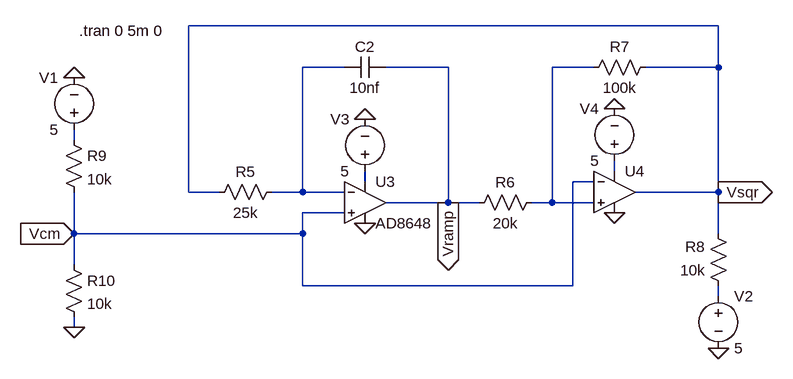
[diagram p0: schematic 01_Ramp_Generator.asc.asc]
01_Ramp_Generator.asc.asc, the LTspice schematic file:
Version 4.1
SHEET 1 928 964
WIRE 464 448 -352 448
WIRE -112 512 -176 512
WIRE 48 512 -48 512
WIRE 272 512 208 512
WIRE 464 512 464 448
WIRE 464 512 352 512
WIRE -528 624 -528 608
WIRE 304 672 304 656
WIRE -80 688 -80 672
WIRE 272 688 240 688
WIRE -352 704 -352 448
WIRE -304 704 -352 704
WIRE -176 704 -176 512
WIRE -176 704 -224 704
WIRE -112 704 -176 704
WIRE 464 704 464 512
WIRE 464 704 336 704
WIRE 48 720 48 512
WIRE 48 720 -48 720
WIRE 96 720 48 720
WIRE 208 720 208 512
WIRE 208 720 176 720
WIRE 272 720 208 720
WIRE -112 736 -176 736
WIRE -528 768 -528 704
WIRE -176 768 -176 736
WIRE -176 768 -528 768
WIRE 464 768 464 704
WIRE -528 816 -528 768
WIRE -176 848 -176 768
WIRE 240 848 240 688
WIRE 240 848 -176 848
WIRE 464 864 464 848
WIRE -528 912 -528 896
FLAG -528 768 Vcm
IOPIN -528 768 In
FLAG -528 528 0
FLAG -528 912 0
FLAG -80 752 0
FLAG 464 944 0
FLAG -80 592 0
FLAG 304 576 0
FLAG 304 736 0
FLAG 464 704 Vsqr
IOPIN 464 704 Out
FLAG 48 720 Vramp
IOPIN 48 720 Out
SYMBOL OpAmps\\AD8648 -80 656 R0
SYMATTR InstName U3
SYMBOL res -208 688 R90
WINDOW 0 0 56 VBottom 2
WINDOW 3 32 56 VTop 2
SYMATTR InstName R5
SYMATTR Value 25k
SYMBOL res 192 704 R90
WINDOW 0 0 56 VBottom 2
WINDOW 3 32 56 VTop 2
SYMATTR InstName R6
SYMATTR Value 20k
SYMBOL res 368 496 R90
WINDOW 0 0 56 VBottom 2
WINDOW 3 32 56 VTop 2
SYMATTR InstName R7
SYMATTR Value 100k
SYMBOL res 480 864 R180
WINDOW 0 36 76 Left 2
WINDOW 3 36 40 Left 2
SYMATTR InstName R8
SYMATTR Value 10k
SYMBOL cap -48 496 R90
WINDOW 0 0 32 VBottom 2
WINDOW 3 32 32 VTop 2
SYMATTR InstName C2
SYMATTR Value 10nf
SYMBOL res -544 608 R0
SYMATTR InstName R9
SYMATTR Value 10k
SYMBOL res -544 800 R0
SYMATTR InstName R10
SYMATTR Value 10k
SYMBOL voltage -528 624 R180
WINDOW 0 24 96 Left 2
WINDOW 3 24 16 Left 2
SYMATTR InstName V1
SYMATTR Value 5
SYMBOL voltage 464 848 R0
WINDOW 123 0 0 Left 0
WINDOW 39 0 0 Left 0
SYMATTR InstName V2
SYMATTR Value 5
SYMBOL voltage -80 688 R180
WINDOW 0 24 96 Left 2
WINDOW 3 24 16 Left 2
WINDOW 123 0 0 Left 0
WINDOW 39 0 0 Left 0
SYMATTR InstName V3
SYMATTR Value 5
SYMBOL voltage 304 672 R180
WINDOW 0 24 96 Left 2
WINDOW 3 24 16 Left 2
WINDOW 123 0 0 Left 0
WINDOW 39 0 0 Left 0
SYMATTR InstName V4
SYMATTR Value 5
SYMBOL OpAmps\\UniversalOpAmp2 304 704 R0
SYMATTR InstName U4
TEXT -520 456 Left 2 !.tran 0 5m 0

The netlist it stands for:
* 01_Ramp_Generator.asc.asc
X§U3 Vcm N001 N005 0 Vramp AD8648  ; pins In+ In- V+ V- OUT
R5 N001 Vsqr 25k
R6 N002 Vramp 20k
R7 Vsqr N002 100k
R8 N006 Vsqr 10k
C2 Vramp N001 10nf
R9 N003 Vcm 10k
R10 Vcm 0 10k
V1 N003 0 5
V2 N006 0 5
V3 N005 0 5
V4 N004 0 5
X§U4 N002 Vcm N004 0 Vsqr level2 Avol=1Meg GBW=10Meg Slew=10Meg Ilimit=25m Rail=0 Vos=0 En=0 Enk=0 In=0 Ink=0 Rin=500Meg  ; pins In+ In- V+ V- OUT
.tran 0 5m 0
.lib ADI.lib
.lib UniversalOpAmp2.lib
.backanno
.end